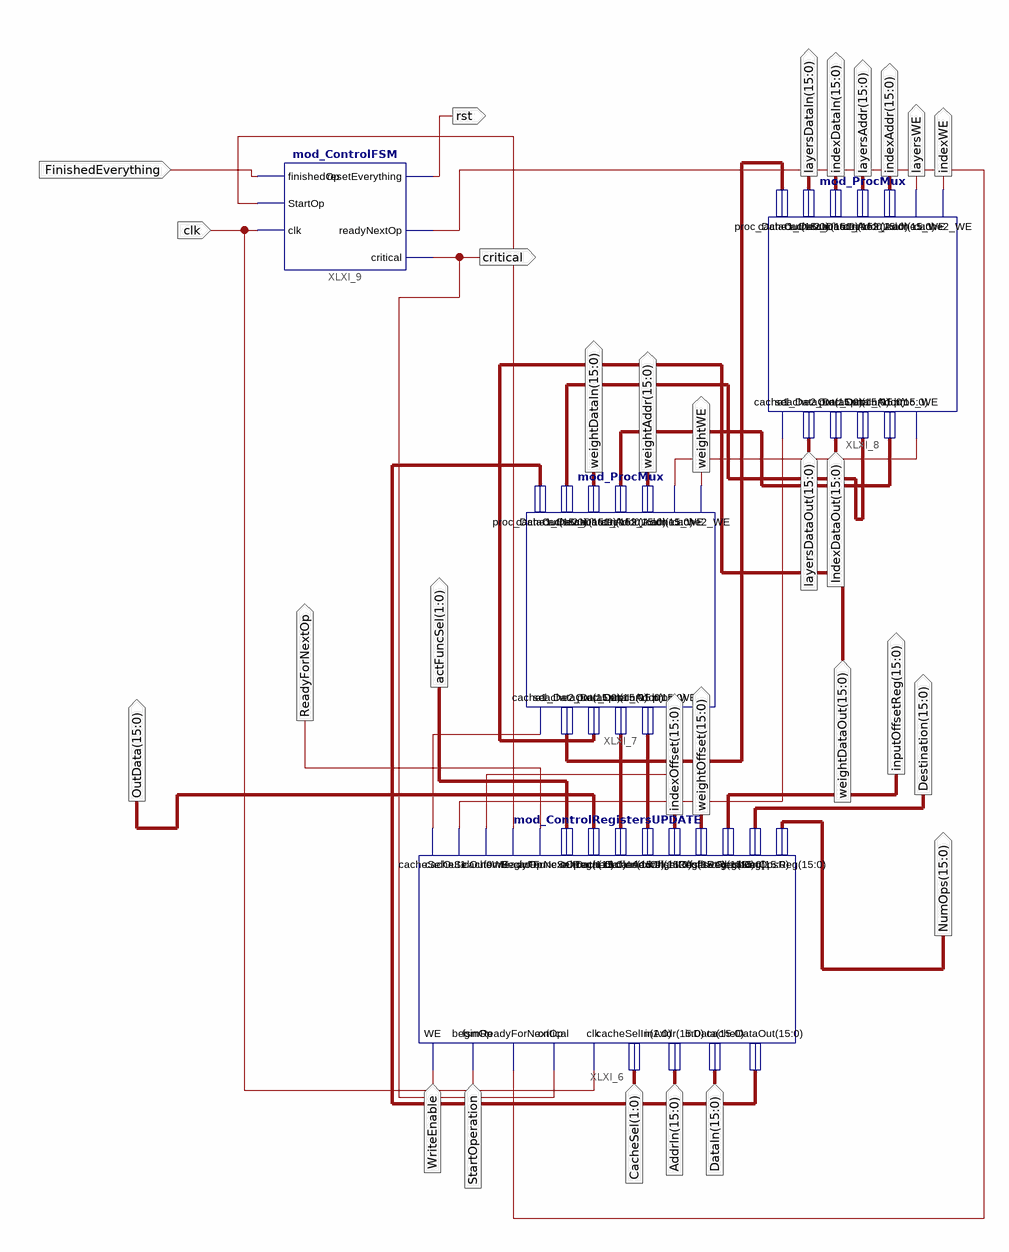
[diagram p0: schematic sheet 1]
// Xilinx ISE schematic mod_ControllerUPDATE.sch (spartan3e) as structural Verilog: 4 symbols, 29 ports
module mod_ControllerUPDATE (
  input  clk,
  input  WriteEnable,
  input  StartOperation,
  input  [1:0] CacheSel,
  input  [15:0] AddrIn,
  input  [15:0] DataIn,
  input  [15:0] IndexDataOut,
  input  [15:0] layersDataOut,
  input  [15:0] weightDataOut,
  input  FinishedEverything,
  output critical,
  output ReadyForNextOp,
  output [1:0] actFuncSel,
  output [15:0] OutData,
  output [15:0] indexOffset,
  output [15:0] weightOffset,
  output [15:0] inputOffsetReg,
  output [15:0] Destination,
  output [15:0] NumOps,
  output [15:0] layersDataIn,
  output [15:0] indexDataIn,
  output [15:0] layersAddr,
  output [15:0] indexAddr,
  output layersWE,
  output indexWE,
  output weightWE,
  output [15:0] weightAddr,
  output [15:0] weightDataIn,
  output rst
);

  wire XLXN_37, XLXN_38, XLXN_46, XLXN_47, XLXN_48, XLXN_72;
  wire [15:0] XLXN_39, XLXN_40, XLXN_42, XLXN_43, XLXN_49, XLXN_50;

  mod_ControlRegistersUPDATE XLXI_6 (
    .WE(WriteEnable), .beginOp(StartOperation), .fsmReadyForNextOp(XLXN_47), .critical(critical), .clk(clk),
    .cacheSelIn(CacheSel), .inAddr(AddrIn), .inData(DataIn), .cacheDataOut(XLXN_42), .cacheSelOut1(XLXN_37),
    .cacheSelOut0(XLXN_38), .cacheWE(XLXN_48), .fsmBeginOp(XLXN_46), .readyForNextOp(ReadyForNextOp),
    .actFuncSelReg(actFuncSel), .outData(OutData), .cacheDataIn(XLXN_50), .cacheAddrIn(XLXN_49),
    .indexOffsetReg(indexOffset), .weightOffsetReg(weightOffset), .offsetReg(inputOffsetReg),
    .destReg(Destination), .numOpsReg(NumOps));
  mod_ProcMux XLXI_7 (
    .sel(XLXN_37), .cache1_DataOut(XLXN_43), .cache2_DataOut(weightDataOut), .proc_DataIn(XLXN_50),
    .proc_Addr(XLXN_49), .proc_WE(XLXN_48), .proc_DataOut(XLXN_42), .cache1_DataIn(XLXN_39),
    .cache2_DataIn(weightDataIn), .cache1_Addr(XLXN_40), .cache2_Addr(weightAddr), .cache1_WE(XLXN_72),
    .cache2_WE(weightWE));
  mod_ProcMux XLXI_8 (
    .sel(XLXN_38), .cache1_DataOut(layersDataOut), .cache2_DataOut(IndexDataOut), .proc_DataIn(XLXN_39),
    .proc_Addr(XLXN_40), .proc_WE(XLXN_72), .proc_DataOut(XLXN_43), .cache1_DataIn(layersDataIn),
    .cache2_DataIn(indexDataIn), .cache1_Addr(layersAddr), .cache2_Addr(indexAddr), .cache1_WE(layersWE),
    .cache2_WE(indexWE));
  mod_ControlFSM XLXI_9 (
    .finishedOp(FinishedEverything), .StartOp(XLXN_46), .clk(clk), .resetEverything(rst),
    .readyNextOp(XLXN_47), .critical(critical));
endmodule
